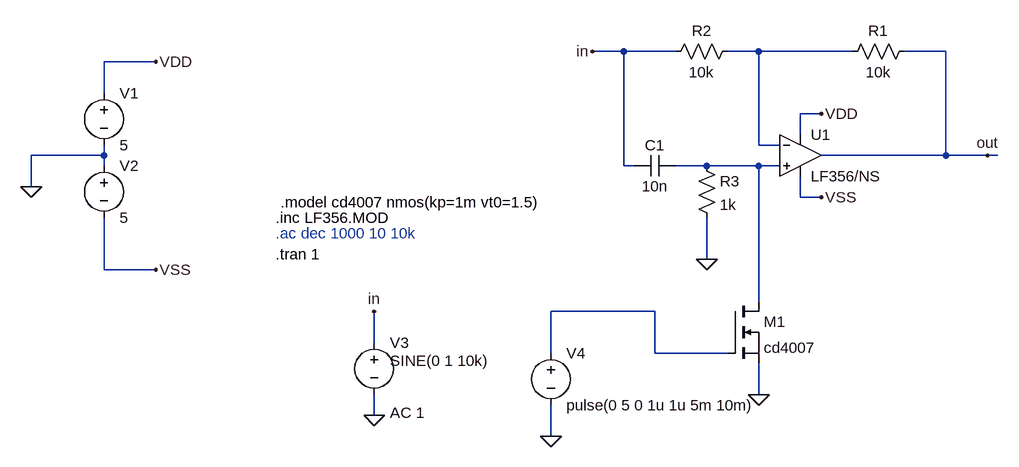
[diagram p0: schematic AllPass_Test.asc]
AllPass_Test.asc, the LTspice schematic file:
Version 4
SHEET 1 1092 680
WIRE 496 -96 448 -96
WIRE 576 -96 496 -96
WIRE 704 -96 656 -96
WIRE 848 -96 704 -96
WIRE 992 -96 928 -96
WIRE -224 -80 -304 -80
WIRE -304 -32 -304 -80
WIRE 800 0 768 0
WIRE 768 32 768 0
WIRE 704 48 704 -96
WIRE 736 48 704 48
WIRE -304 64 -304 48
WIRE -304 64 -416 64
WIRE 992 64 992 -96
WIRE 992 64 800 64
WIRE 1056 64 992 64
WIRE 1072 64 1056 64
WIRE -304 80 -304 64
WIRE 496 80 496 -96
WIRE 512 80 496 80
WIRE 624 80 576 80
WIRE 704 80 624 80
WIRE 736 80 704 80
WIRE -416 112 -416 64
WIRE 768 128 768 96
WIRE 800 128 768 128
WIRE 624 224 624 160
WIRE -304 240 -304 160
WIRE -224 240 -304 240
WIRE 704 288 704 80
WIRE 544 304 384 304
WIRE 112 352 112 304
WIRE 384 368 384 304
WIRE 544 368 544 304
WIRE 656 368 544 368
WIRE 704 432 704 384
WIRE 112 464 112 432
WIRE 384 496 384 448
FLAG -416 112 0
FLAG -224 240 VSS
FLAG -224 -80 VDD
FLAG 800 0 VDD
FLAG 800 128 VSS
FLAG 1056 64 out
FLAG 448 -96 in
FLAG 624 224 0
FLAG 112 464 0
FLAG 112 304 in
FLAG 704 432 0
FLAG 384 496 0
SYMBOL voltage -304 -48 R0
WINDOW 123 0 0 Left 0
WINDOW 39 0 0 Left 0
SYMATTR InstName V1
SYMATTR Value 5
SYMBOL voltage -304 64 R0
WINDOW 123 0 0 Left 0
WINDOW 39 0 0 Left 0
SYMATTR InstName V2
SYMATTR Value 5
SYMBOL OpAmps\\opamp2 768 0 R0
SYMATTR InstName U1
SYMATTR Value LF356/NS
SYMBOL res 672 -112 R90
WINDOW 0 0 56 VBottom 2
WINDOW 3 32 56 VTop 2
SYMATTR InstName R2
SYMATTR Value 10k
SYMBOL res 944 -112 R90
WINDOW 0 0 56 VBottom 2
WINDOW 3 32 56 VTop 2
SYMATTR InstName R1
SYMATTR Value 10k
SYMBOL cap 576 64 R90
WINDOW 0 0 32 VBottom 2
WINDOW 3 32 32 VTop 2
SYMATTR InstName C1
SYMATTR Value 10n
SYMBOL res 608 64 R0
SYMATTR InstName R3
SYMATTR Value 1k
SYMBOL voltage 112 336 R0
WINDOW 123 24 124 Left 2
WINDOW 39 0 0 Left 0
WINDOW 3 24 44 Left 2
SYMATTR Value2 AC 1
SYMATTR InstName V3
SYMATTR Value SINE(0 1 10k)
SYMBOL nmos 656 288 R0
SYMATTR InstName M1
SYMATTR Value cd4007
SYMBOL voltage 384 352 R0
SYMATTR InstName V4
SYMATTR Value pulse(0 5 0 1u 1u 5m 10m)
TEXT -40 184 Left 2 ;.ac dec 1000 10 10k
TEXT -40 160 Left 2 !.inc LF356.MOD
TEXT -32 136 Left 2 !.model cd4007 nmos(kp=1m vt0=1.5)
TEXT -40 216 Left 2 !.tran 1

The netlist it stands for:
* AllPass_Test.asc
V1 VDD 0 5
V2 0 VSS 5
XU1 N002 N001 VDD VSS out LF356/NS  ; pins In+ In- V+ V- OUT
R2 N001 in 10k
R1 out N001 10k
C1 N002 in 10n
R3 N002 0 1k
V3 in 0 SINE(0 1 10k) AC 1
M1 N002 N003 0 0 cd4007
V4 N003 0 pulse(0 5 0 1u 1u 5m 10m)
.model NMOS NMOS
.model PMOS PMOS
.lib standard.mos
* .ac dec 1000 10 10k
.inc LF356.MOD
.model cd4007 nmos(kp=1m vt0=1.5)
.tran 1
.backanno
.end